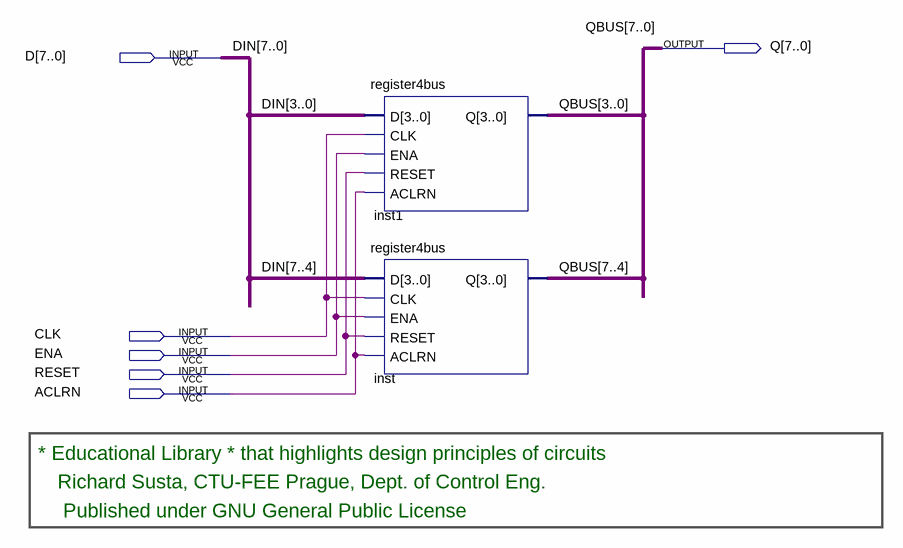
[diagram p0: schematic sheet]
// Quartus schematic register8bus.bdf as structural Verilog: 2 symbols, 6 pins
module register8bus (
  input  [7:0] D,
  input  CLK,
  input  ENA,
  input  RESET,
  input  ACLRN,
  output [7:0] Q
);

  register4bus inst1 (.D(D[3:0]), .CLK(CLK), .ENA(ENA), .RESET(RESET), .ACLRN(ACLRN), .Q(Q[3:0]));
  register4bus inst (.D(D[7:4]), .CLK(CLK), .ENA(ENA), .RESET(RESET), .ACLRN(ACLRN), .Q(Q[7:4]));

  // Other names for the same wires on the sheet: DIN[7:0] = D; QBUS[7:0] = Q

  // Notes on the sheet:
  //   * Educational Library * that highlights design principles of circuits
  //   Richard Susta, CTU-FEE Prague, Dept. of Control Eng. 
  //    Published under GNU General Public License
endmodule
